# EAGLE design energy_counter_rfm70 (EAGLE 6.1)
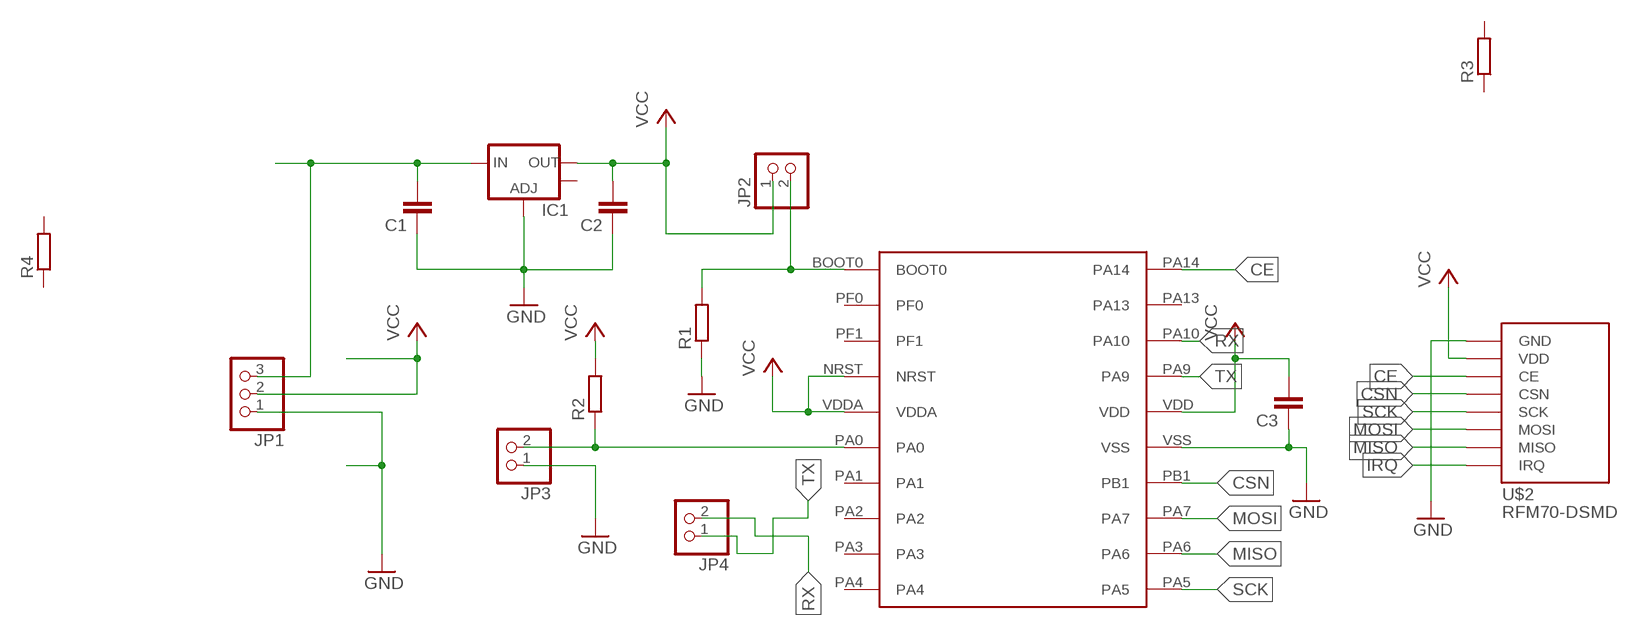
[diagram p0: schematic, sheet 1]

## Parts
C1  C-EUC1206  [C1206]
C2  C-EUC0805  [C0805]
C3  C-EUC0805  [C0805]
IC1  V_REG_LM1117SOT223  [SOT223]
JP1  PINHD-1X3/90  [1X03/90]
JP2  PINHD-1X2/90  [1X02/90]
JP3  PINHD-1X2/90  [1X02/90]
JP4  PINHD-1X2/90  [1X02/90]
R1  R-EU_R1206  [R1206]
R2  R-EU_R0805  [R0805]
R3  R-EU_R1206  [R1206]
R4  R-EU_R1206  [R1206]
U$1  STM32F0  [TSSOP20]
U$2  RFM70-DSMD  [RFM70-SMD]

## Nets
CE: U$1.PA14 U$2.CE
CSN: U$1.PB1 U$2.CSN
GND: C1.1 C2.1 C3.1 IC1.1(ADJ) JP1.1 JP3.1 R1.1 U$1.VSS U$2.GND
IRQ: U$2.IRQ
MISO: U$1.PA6 U$2.MISO
MOSI: U$1.PA7 U$2.MOSI
N$1: C1.2 IC1.3(IN) JP1.3
N$3: JP2.2 R1.2 U$1.BOOT0
N$5: JP3.2 R2.1 U$1.PA0
RX: JP4.2 U$1.PA10
SCK: U$1.PA5 U$2.SCK
TX: JP4.1 U$1.PA9
VCC: C2.2 C3.2 IC1.2(OUT) JP1.2 JP2.1 R2.2 U$1.NRST U$1.VDD U$1.VDDA U$2.VDD
Unconnected: IC1.4(OUT) R3.1 R3.2 R4.1 R4.2 U$1.PA1 U$1.PA2 U$1.PA3 U$1.PA4 U$1.PA13 U$1.PF0 U$1.PF1

## Library data of the parts
C1-C3 = rcl-kd:C-EU: CAPACITOR, European symbol
IC1 = SparkFun:V_REG_LM1117: Voltage Regulator LM1117 Standard adjustable voltage regulator but in SMD form. Spark Fun Electronics SKU : COM-00595
JP1 = pinhead-kd:PINHD-1X3: PIN HEADER
JP2-JP4 = pinhead-kd:PINHD-1X2: PIN HEADER
R1-R4 = rcl-kd:R-EU_: RESISTOR, European symbol
U$1 = kd:STM32F0
U$2 = RFM70:RFM70-D: maciek@chwarzno.pl Maciej Kalinowski RFM70-D

## Board
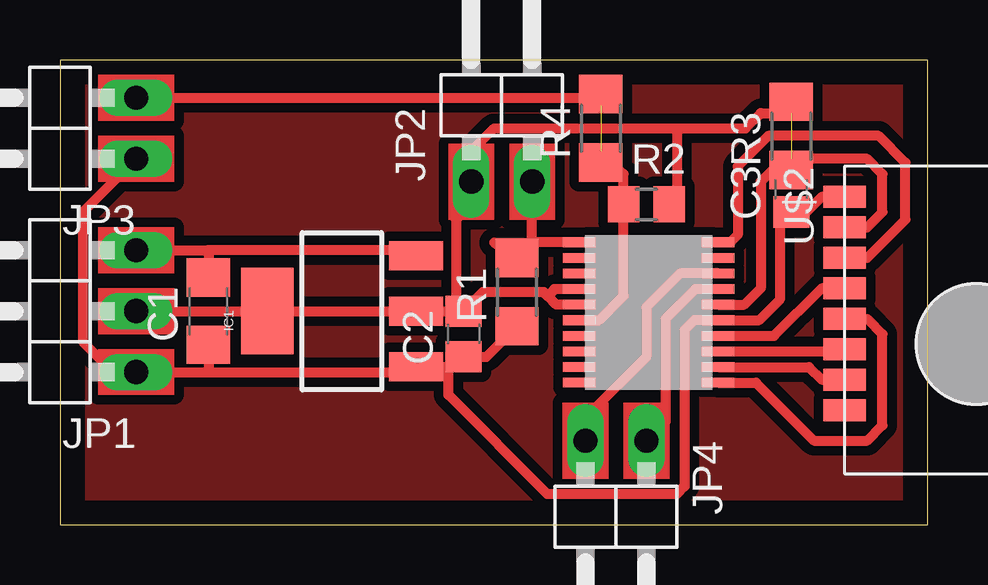
[diagram p1: board, top side]

Size 36.18 x 19.36 mm. Coordinates in mm from the lower left corner, seen from the top.
Outline: 0,0 36.18,0 36.18,19.36 0,19.36 0,0
Copper layers (1*16): Top 0.035mm / dielectric 1.5mm / Bottom 0.035mm
Design rules: minimum track width 10mil, minimum drill 24mil, track to track 8mil, track to pad 8mil, pad to pad 8mil, via to via 8mil, smd to smd 8mil, copper to edge 40mil, drill to drill 8mil, minimum pad ring 10mil, minimum via ring 8mil, stop-mask expansion 4mil, vias tented up to drill 0mil, thermal gap 10mil

### Footprints (pad centres in the part's own frame; a part is rotated, then mirrored left to right if it is on the bottom)
C1206 = smd 1.6 x 1.8: 1 -1.4,0; 2 1.4,0
C0805 = smd 1.3 x 1.5: 1 -0.95,0; 2 0.95,0
SOT223 = smd 1.219 x 2.235: 1 -2.311,-3.099; 2 0,-3.099; 3 2.311,-3.099 | smd 3.6 x 2.2: 4 0,3.099
1X03/90 = drill 1.016 long: 1 -2.54,-3.81; 2 0,-3.81; 3 2.54,-3.81
1X02/90 = drill 1.016 long: 1 -1.27,-3.81; 2 1.27,-3.81
R1206 = smd 1.6 x 1.803: 1 -1.422,0; 2 1.422,0
R0805 = smd 1.3 x 1.5: 1 -0.95,0; 2 0.95,0
TSSOP20 = smd 1.35 x 0.4: BOOT0 -0.9,0.65; NRST -0.9,-1.3; PA0 -0.9,-2.6; PA1 -0.9,-3.25; PA2 -0.9,-3.9; PA3 -0.9,-4.55; PA4 -0.9,-5.2; PA5 4.9,-5.2; PA6 4.9,-4.55; PA7 4.9,-3.9; PA9 4.9,-1.3; PA10 4.9,-0.65; PA13 4.9,0; PA14 4.9,0.65; PB1 4.9,-3.25; PF0 -0.9,0; PF1 -0.9,-0.65; VDD 4.9,-1.95; VDDA -0.9,-1.95; VSS 4.9,-2.6
RFM70-SMD = smd 0.914 x 1.778: CE -2.54,-6.35; CSN -1.27,-6.35; GND -5.08,-6.35; IRQ 3.81,-6.35; MISO 2.54,-6.35; MOSI 1.27,-6.35; SCK 0,-6.35; VDD -3.81,-6.35

### Placement (x,y rotation side)
C1  6.19,8.89 90 top
C2  16.83,7.94 90 top
C3  30.48,13.97 90 top
IC1  11.75,8.89 90 top
JP1  -0.64,8.89 90 top
JP2  18.41,18.1 0 top
JP3  -0.64,16.51 90 top
JP4  23.18,-0.32 180 top
R1  19.05,9.68 90 top
R2  24.45,13.34 0 top
R3  30.48,16.19 90 top
R4  22.54,16.51 90 top
U$1  22.54,11.11 0 top
U$2  39.05,8.57 270 top

### Tracks (layer width: path | path; a pad name or v marks a point on that pad's centre or on a via)
CE
  Top 0.406: U$2.CE 33.66,11.11 35.24,12.7 35.24,15.08 34.13,16.19 29.53,16.19 28.26,14.92 28.26,12.06 27.95,11.76 U$1.PA14
CSN
  Top 0.406: U$1.PB1 29.77,7.86 31.75,9.84 U$2.CSN
GND
  Top 0.406: U$2.GND 31.75,13.65 31.11,13.02 C3.1 | C3.1 30,12.54 30,9.37 29.15,8.51 U$1.VSS 26.45,8.51 26.04,8.1 26.04,1.59 25.72,1.27 20.32,1.27 16.19,5.4 16.19,6.58 | 6.19,6.35 JP1.1 2.22,6.35 0.95,7.62 0.95,13.02 JP3.1 | 6.19,6.35 14.62,6.35 IC1.1 16.19,6.58 | C1.1 6.19,6.35 | 16.19,6.58 16.42,6.58 C2.1 17.78,6.99 R1.1 | C3.1
MISO
  Top 0.406: U$1.PA6 31.22,6.56 31.75,6.03 U$2.MISO
MOSI
  Top 0.406: U$1.PA7 32.61,7.21 U$2.MOSI
N$1
  Top 0.406: IC1.3 14.62,11.43 6.19,11.43 | JP1.3 6.19,11.43 | 6.19,11.43 C1.2
N$2
  pour Top (isolate 0.406): 0.64,18.73 35.56,18.73 35.56,0.64 0.64,0.64
N$3
  Top 0.406: 19.68,11.75 JP2.2 | R1.2 18.1,11.75 19.68,11.75 | U$1.BOOT0 19.7,11.76 19.68,11.75
N$4
  cutout Top: 21.91,12.38 27.3,12.38 27.3,5.4 21.91,5.4
N$5  (1 unrouted)
  Top 0: R2.1
  Top 0.406: U$1.PA0 22.48,8.51 23.5,9.53 R2.1 23.5,14.61 22.54,15.56 | JP3.2 22.22,17.78 22.54,17.46
RX
  Top 0.406: U$1.PA10 25.86,10.46 24.45,9.05 24.45,6.98 21.91,4.45 JP4.2
SCK
  Top 0.406: U$1.PA5 29.01,5.91 31.43,3.49 33.66,3.49 34.29,4.13 34.29,7.94 33.66,8.57 U$2.SCK
TX
  Top 0.406: U$1.PA9 26.48,9.81 25.24,8.57 25.24,4.29 JP4.1
VCC  (1 unrouted)
  Top 0: R2.2 25.72,13.34
  Top 0.406: U$2.VDD 33.66,12.38 34.29,13.02 34.29,14.61 33.66,15.24 30.48,15.24 | 30.48,15.24 30.16,15.24 29.21,14.29 29.21,9.84 28.53,9.16 U$1.VDD | U$1.VDDA 20.68,9.16 20.32,9.53 | 15.12,9.16 IC1.2 | JP1.2 IC1.2 | 25.72,16.51 18.1,16.51 17.14,15.56 JP2.1 17.14,13.34 16.51,12.7 16.51,9.2 C2.2 | 25.72,16.51 25.72,13.34 | 20.32,9.53 20.16,9.68 17.62,9.68 C2.2 | IC1.2 C2.2 | C3.2 30.48,15.24 | U$1.NRST 20.61,9.81 20.32,9.53 | 25.72,16.51 28.57,16.51 29.21,17.14 30.48,17.14
(copper drawn outside any net)
  shapes: Top area x11